# EAGLE design pi_hat_v2 (EAGLE 9.6.2)
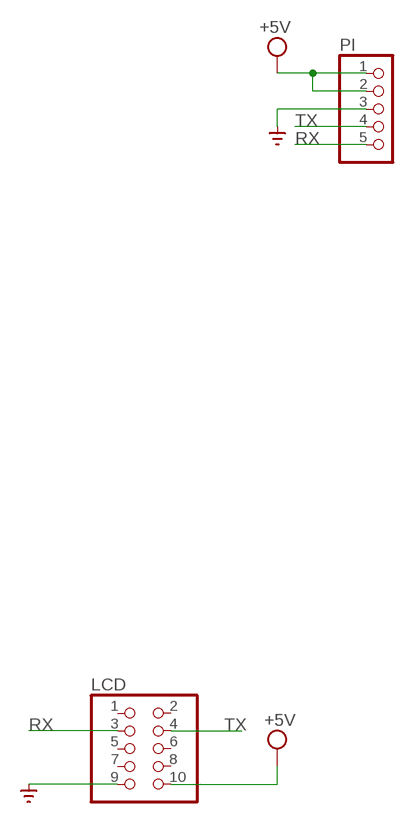
[diagram p0: schematic, sheet 1]

## Parts
LCD  PINHD-2X5/90  [2X05/90]
PI  PINHD-1X5  [1X05]

## Nets
+5V: LCD.10 PI.1 PI.2
GND: LCD.9 PI.3 ; supply symbol labelled SUPPLY0_GND_
RX: LCD.3 PI.5
TX: LCD.4 PI.4
Unconnected: LCD.1 LCD.2 LCD.5 LCD.6 LCD.7 LCD.8

## Library data of the parts
LCD = pinhead:PINHD-2X5: PIN HEADER
PI = pinhead:PINHD-1X5: PIN HEADER

## Board
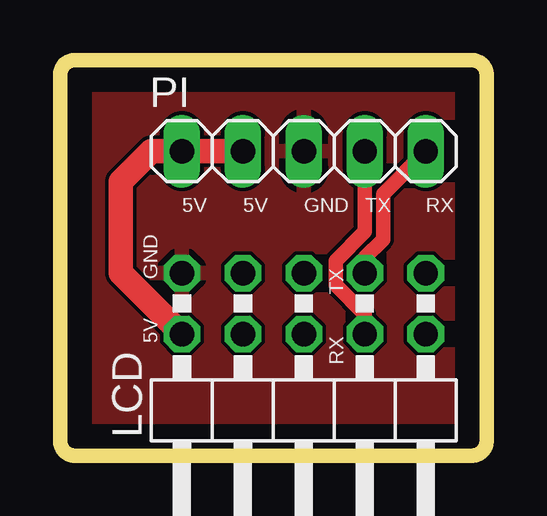
[diagram p1: board, top side]
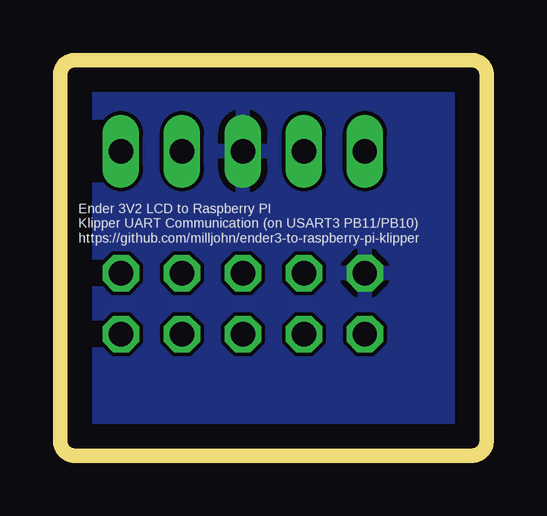
[diagram p2: board, bottom side, seen from below]

Size 17.78 x 16.51 mm. Coordinates in mm from the lower left corner, seen from the top.
Outline: 17.14,0 0.64,0 arc-90 0,0.64 0,15.88 arc-90 0.64,16.51 17.14,16.51 arc-90 17.78,15.88 17.78,0.64 arc-90 17.14,0
Copper layers (1*16): Top 0.035mm / dielectric 1.5mm / Bottom 0.035mm
Design rules "default *": minimum track width 6mil, minimum drill 0.35mm, track to track 6mil, track to pad 6mil, pad to pad 6mil, via to via 6mil, smd to smd 6mil, copper to edge 40mil, drill to drill 6mil, minimum pad ring 10mil, minimum via ring 8mil, stop-mask expansion 4mil, vias tented up to drill 40mil, thermal gap 10mil

### Footprints (pad centres in the part's own frame; a part is rotated, then mirrored left to right if it is on the bottom)
2X05/90 = drill 1.016 octagon: 1 -5.08,-6.35; 2 -5.08,-3.81; 3 -2.54,-6.35; 4 -2.54,-3.81; 5 0,-6.35; 6 0,-3.81; 7 2.54,-6.35; 8 2.54,-3.81; 9 5.08,-6.35; 10 5.08,-3.81
1X05 = drill 1.016 long: 1 -5.08,0; 2 -2.54,0; 3 0,0; 4 2.54,0; 5 5.08,0

### Placement (x,y rotation side)
LCD  10.16,1.27 180 top
PI  10.16,12.7 0 top

### Tracks (layer width: path | path; a pad name or v marks a point on that pad's centre or on a via)
+5V
  Top 1.016: PI.2 PI.1 3.81,12.7 2.54,11.43 2.54,7.62 LCD.10
GND
  pour Top: 0,15.88 0,0.64 arc90 0.64,0 17.14,0 arc90 17.78,0.64 17.78,15.88 arc90 17.14,16.51 0.64,16.51 arc90
  pour Bottom: 0,15.88 0,0.64 arc90 0.64,0 17.14,0 arc90 17.78,0.64 17.78,15.88 arc90 17.14,16.51 0.64,16.51 arc90
RX
  Top 0.61: LCD.3 12.7,8.27 13.46,9.03 13.46,10.92 PI.5
TX
  Top 0.61: LCD.4 12.7,5.9 11.48,7.12 11.48,8.12 12.7,9.34 PI.4

### Text on the board
tNames: 5V | 5V | GND | TX | RX | GND | TX | 5V | RX
bNames: Ender 3V2 LCD to Raspberry PI / Klipper UART Communication (on USART3 PB11/PB10) / https://github.com/milljohn/ender3-to-raspberry-pi-klipper